# Altium schematic sheet 16_HDMI接口.schdoc.schdoc
size 309 x 223 mm; Symbol: Sheet-Symbol_A4; Device: Sheet-Symbol_A4; Company: 嘉立创EDA; Version: V1.0; Page Size: A4; @Project Name: RK3568底板_V1.2; @Page Count: 6; @Update Date: 2024-04-26; @Create Date: 2024-04-18; @Schematic Name: 原理图; @Page No: 4; @Page Name: HDMI接口
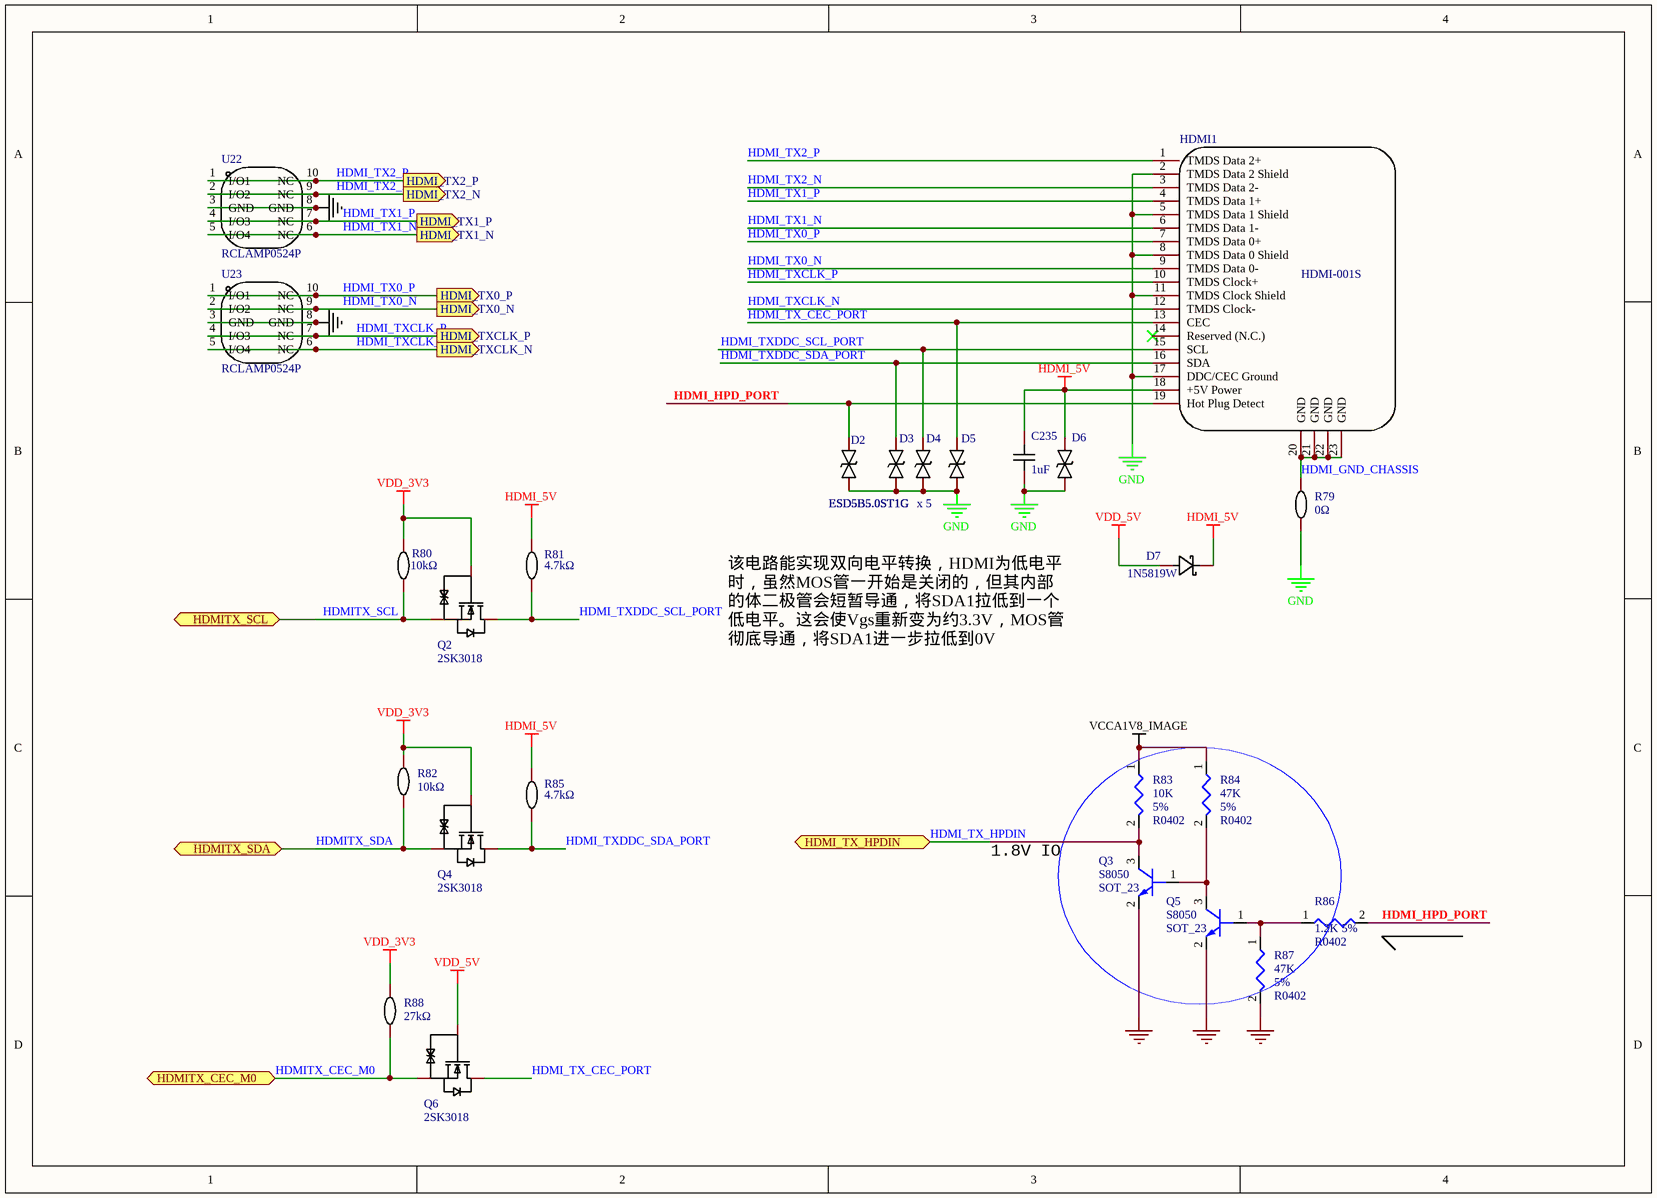
[diagram p0: 16_HDMI接口.schdoc.schdoc]

## Parts
C235  1uF  [C0603]
D2  ESD5B5.0ST1G  [SOD-523_L1.2-W0.8-LS1.6-BI]
D3  ESD5B5.0ST1G  [SOD-523_L1.2-W0.8-LS1.6-BI]
D4  ESD5B5.0ST1G  [SOD-523_L1.2-W0.8-LS1.6-BI]
D5  ESD5B5.0ST1G  [SOD-523_L1.2-W0.8-LS1.6-BI]
D6  ESD5B5.0ST1G  [SOD-523_L1.2-W0.8-LS1.6-BI]
D7  1N5819W  [SOD-123_L2.7-W1.6-LS3.7-R-RD]
HDMI1  HDMI-001S  [HDMI-SMD_HDMI-001S]
Q2  2SK3018  [SOT-23-3_L2.9-W1.4-P1.90-LS2.6-BR]
Q3  S8050  [SOT_23]
Q4  2SK3018  [SOT-23-3_L2.9-W1.4-P1.90-LS2.6-BR]
Q5  S8050  [SOT_23]
Q6  2SK3018  [SOT-23-3_L2.9-W1.4-P1.90-LS2.6-BR]
R79  0Ω  [R0603]
R80  10kΩ  [R0603]
R81  4.7kΩ  [R0603]
R82  10kΩ  [R0603]
R83  10K  Tolerance: 5%  [R0402]
R84  47K  Tolerance: 5%  [R0402]
R85  4.7kΩ  [R0603]
R86  1.2K  Tolerance: 5%  [R0402]
R87  47K  Tolerance: 5%  [R0402]
R88  27kΩ  [R0603]
U22  RCLAMP0524P  [DFN2510-10_L2.5-W1.0-P0.50-BL]
U23  RCLAMP0524P  [DFN2510-10_L2.5-W1.0-P0.50-BL]

## Ports
HDMI_TX0_N (out), HDMI_TX0_P (out), HDMI_TX1_N (out), HDMI_TX1_P (out), HDMI_TX2_N (out), HDMI_TX2_P (out), HDMI_TX_HPDIN (bidir), HDMI_TXCLK_N (out), HDMI_TXCLK_P (out), HDMITX_CEC_M0 (bidir), HDMITX_SCL (bidir), HDMITX_SDA (bidir)

## Nets
GND: C235.1 D2.1 D3.1 D4.1 D5.1 D6.1 HDMI1.2(TMDS_Data_2_Shield) HDMI1.5(TMDS_Data_1_Shield) HDMI1.8(TMDS_Data_0_Shield) HDMI1.11(TMDS_Clock_Shield) HDMI1.17(DDC/CEC_Ground) Q3.2(EMITTER) Q5.2(EMITTER) R79.1 R87.2 U22.3(GND) U22.8(GND) U23.3(GND) U23.8(GND)
HDMI_5V: C235.2 D6.2 D7.2(C) HDMI1.18(+5V_Power) R81.2 R85.2
VCCA1V8_IMAGE: R83.1 R84.1
VDD_3V3: Q2.1(G) Q4.1(G) R80.2 R82.2 R88.2
VDD_5V: D7.1(A) Q6.1(G)
HDMI_GND_CHASSIS: HDMI1.20(GND) HDMI1.21(GND) HDMI1.22(GND) HDMI1.23(GND) R79.2
HDMI_HPD_PORT: D2.2 HDMI1.19(Hot_Plug_Detect) R86.2
HDMI_TX0_N: HDMI1.9(TMDS_Data_0-) U23.2(I/O2) U23.9(NC) ; port HDMI_TX0_N
HDMI_TX0_P: HDMI1.7(TMDS_Data_0+) U23.1(I/O1) U23.10(NC) ; port HDMI_TX0_P
HDMI_TX1_N: HDMI1.6(TMDS_Data_1-) U22.5(I/O4) U22.6(NC) ; port HDMI_TX1_N
HDMI_TX1_P: HDMI1.4(TMDS_Data_1+) U22.4(I/O3) U22.7(NC) ; port HDMI_TX1_P
HDMI_TX2_N: HDMI1.3(TMDS_Data_2-) U22.2(I/O2) U22.9(NC) ; port HDMI_TX2_N
HDMI_TX2_P: HDMI1.1(TMDS_Data_2+) U22.1(I/O1) U22.10(NC) ; port HDMI_TX2_P
HDMI_TX_CEC_PORT: D5.2 HDMI1.13(CEC) Q6.3(D)
HDMI_TX_HPDIN: Q3.3(COLLECTOR) R83.2 ; port HDMI_TX_HPDIN
HDMI_TXCLK_N: HDMI1.12(TMDS_Clock-) U23.5(I/O4) U23.6(NC) ; port HDMI_TXCLK_N
HDMI_TXCLK_P: HDMI1.10(TMDS_Clock+) U23.4(I/O3) U23.7(NC) ; port HDMI_TXCLK_P
HDMI_TXDDC_SCL_PORT: D4.2 HDMI1.15(SCL) Q2.3(D) R81.1
HDMI_TXDDC_SDA_PORT: D3.2 HDMI1.16(SDA) Q4.3(D) R85.1
HDMITX_CEC_M0: Q6.2(S) R88.1 ; port HDMITX_CEC_M0
HDMITX_SCL: Q2.2(S) R80.1 ; port HDMITX_SCL
HDMITX_SDA: Q4.2(S) R82.1 ; port HDMITX_SDA
NetQ3_1: Q3.1(BASE) Q5.3(COLLECTOR) R84.2
NetQ5_1: Q5.1(BASE) R86.1 R87.1

Not connected (* = marked no-connect by the designer): HDMI1 14(Reserved_(N.C.))*

## Notes on the sheet
- x 5
- 该电路能实现双向电平转换，HDMI为低电平时，虽然MOS管一开始是关闭的，但其内部的体二极管会短暂导通，将SDA1拉低到一个低电平。这会使Vgs重新变为约3.3V，MOS管彻底导通，将SDA1进一步拉低到0V
- 1.8V IO
- 1
- 2
- 3
- 4
- 5
- 6
- A
- B
- C
- 原理图
- 创建日期
- 更新日期
- 2024-04-26
- 2024-04-18
- 审阅
- 绘制
- 图页
- HDMI接口
- 物料编码
- RK3568底板_V1.2
- D
- 版本
- 尺寸
- 页
- 共
- V1.0
- A4
- 嘉立创EDA

## Library data of the parts
C235 = CL10A105KB8NNNC: Manufacturer: SAMSUNG(三星); Add into BOM: yes; Tolerance: ±10%; Voltage Rated: 50V; Temperature Coefficient: X5R; Name: 1uF; Symbol: CL10A105KB8NNNC; Device: CL10A105KB8NNNC; LCSC Part Name: 1uF ±10% 50V; Supplier Part: C15849; Manufacturer Part: CL10A105KB8NNNC; Supplier Footprint: 0603; JLCPCB Part Class: 基础库; Datasheet: https://atta.szlcsc.com/upload/public/pdf/source/20160218/1457707763339.pdf; Supplier: LCSC; Convert to PCB: yes; Value: 1uF
D2-D6 = ESD5B5.0ST1G: Manufacturer: onsemi(安森美); Add into BOM: yes; polarity: 双向; Reverse Stand-Off Voltage (Vrwm): 5V; Peak Pulse Power Dissipation (Ppp)@10/1000us: 50W; Breakdown Voltage: 5.8V; Type: ESD; Name: ESD5B5.0ST1G; Symbol: ESD5B5.0ST1G; Device: ESD5B5.0ST1G; Supplier: LCSC; Manufacturer Part: ESD5B5.0ST1G; Supplier Part: C93623; JLCPCB Part Class: 扩展库; LCSC Part Name: 双向ESD; Supplier Footprint: SOD-523; Datasheet: https://atta.szlcsc.com/upload/public/pdf/source/20170728/C93623_1501225905857849086.PDF; Convert to PCB: yes; Operating Temperature: -55℃~+150℃@(Tj)
D7 = 1N5819W_C963381: Manufacturer: JSMSEMI(杰盛微); Add into BOM: yes; Diode Configuration: 独立式; Forward Voltage (Vf@If): 600mV@200mA; Reverse Voltage (Vr): 40V; Average Rectified Current (Io): 350mA; Reverse Leakage Current (Ir): 5uA@30V; Name: 1N5819W; Symbol: 1N5819W_C963381; Device: 1N5819W_C963381; LCSC Part Name: 电压:40V 电流:350mA; Supplier Part: C963381; Manufacturer Part: 1N5819W; Supplier Footprint: SOD-123; JLCPCB Part Class: 扩展库; Datasheet: https://atta.szlcsc.com/upload/public/pdf/source/20230807/ADD53622154D5B572F84A7B877E922CE.pdf; Supplier: LCSC; Convert to PCB: yes
HDMI1 = HDMI-001S: Manufacturer: XUNPU(讯普); Add into BOM: yes; Connector Type: HDMI; Gender: 母; Current Rating (Max): 500mA; Name: HDMI-001S; Symbol: HDMI-001S; Device: HDMI-001S; LCSC Part Name: HDMI 母 P数:19P; Supplier Part: C720616; Manufacturer Part: HDMI-001S; Supplier Footprint: SMD; JLCPCB Part Class: 扩展库; Datasheet: https://atta.szlcsc.com/upload/public/pdf/source/20230810/ECFF1CC9EF38DC7E290ED6B9AC4EFC06.pdf; Supplier: LCSC; Convert to PCB: yes; Number of Pins: 19P; Mounting Style: 卧贴; Number of Rows: 1; Contact Material: -; Contact Plating: -; Operating Temperature Range: -45℃~+85℃
Q2 Q4 Q6 = 2SK3018: Manufacturer: TWGMC(台湾迪嘉); Symbol: 2SK3018_C727148; Add into BOM: yes; Name: 2SK3018; Device: 2SK3018; Supplier: LCSC; Supplier Part: C727148; Manufacturer Part: 2SK3018; JLCPCB Part Class: 扩展库; LCSC Part Name: 2SK3018; Supplier Footprint: SOT-23; Datasheet: https://atta.szlcsc.com/upload/public/pdf/source/20200827/C727148_2301BBDB89FCE642A4A39ABEF7075607.pdf; Convert to PCB: yes; Type: -; Drain Source Voltage (Vdss): -; Continuous Drain Current (Id): -; Power Dissipation (Pd): -; Drain Source On Resistance (RDS(on)@Vgs,Id): -; Gate Threshold Voltage (Vgs(th)@Id): -; Total Gate Charge (Qg@Vgs): -; Input Capacitance (Ciss@Vds): -; Reverse Transfer Capacitance (Crss@Vds): -
Q3 Q5 = NPN: S8050,SOT23; Manufacturer PN: S8050_SOT23; Manufacturer: 长电; Pc: 0.3W; Vceo: 25V; Ic: 0.5A; Priority: A; PCB Footprint: SOT_23; Created by: JJJ; Part Type: NPN; RK PN: S8050
R79 = 0603WAF0000T5E: Manufacturer: UNI-ROYAL(厚声); Add into BOM: yes; Tolerance: ±1%; Power(Watts): 100mW; Overload Voltage (Max): 75V; Name: 0Ω; Symbol: 0603WAF0000T5E; Device: 0603WAF0000T5E; Supplier: LCSC; Manufacturer Part: 0603WAF0000T5E; Supplier Part: C21189; Value: 0Ω; JLCPCB Part Class: 基础库; LCSC Part Name: 0Ω ±1% 100mW 厚膜电阻; Supplier Footprint: 0603; Datasheet: https://atta.szlcsc.com/upload/public/pdf/source/20200306/C422600_1E6D84923E4A46A82E41ADD87F860B5C.pdf; Convert to PCB: yes; Type: 厚膜电阻; Operating Temperature Range: -55℃~+155℃
R80 R82 = 0603WAF1002T5E: Manufacturer: UNI-ROYAL(厚声); Add into BOM: yes; Tolerance: ±1%; Power(Watts): 100mW; Overload Voltage (Max): 75V; Temperature Coefficient: ±100ppm/℃; Name: 10kΩ; Symbol: 0603WAF1002T5E; Device: 0603WAF1002T5E; Supplier: LCSC; Manufacturer Part: 0603WAF1002T5E; Supplier Part: C25804; Value: 10kΩ; JLCPCB Part Class: 基础库; LCSC Part Name: 厚膜电阻 10kΩ ±1% 100mW; Supplier Footprint: 0603; Datasheet: https://atta.szlcsc.com/upload/public/pdf/source/20200306/C422600_1E6D84923E4A46A82E41ADD87F860B5C.pdf; Convert to PCB: yes; Type: 厚膜电阻; Operating Temperature Range: -55℃~+155℃
R81 R85 = 0603WAF4701T5E: Manufacturer: UNI-ROYAL(厚声); Add into BOM: yes; Tolerance: ±1%; Power(Watts): 100mW; Overload Voltage (Max): 75V; Temperature Coefficient: ±100ppm/℃; Name: 4.7kΩ; Symbol: 0603WAF4701T5E; Device: 0603WAF4701T5E; Supplier: LCSC; Manufacturer Part: 0603WAF4701T5E; Supplier Part: C23162; Value: 4.7kΩ; JLCPCB Part Class: 基础库; LCSC Part Name: 4.7kΩ ±1% 100mW 厚膜电阻; Supplier Footprint: 0603; Datasheet: https://atta.szlcsc.com/upload/public/pdf/source/20200306/C422600_1E6D84923E4A46A82E41ADD87F860B5C.pdf; Convert to PCB: yes; Type: 厚膜电阻; Operating Temperature Range: -55℃~+155℃
R83 = RESISTOR_Dup1: 通用厚膜电阻,10K,+/-5%,R0402,1/16W.; Manufacturer: YAGEO; RK PN: RC0402JR-0710KL; Priority: A; Wattage: 1/16W; PCB Footprint: R0402; Part Type: 通用厚膜电阻; Manufacturer PN: RC0402JR-0710KL; Created by: YTL
R84 R87 = RESISTOR_Dup1: 通用厚膜电阻,47K,+/-5%,R0402,1/16W.; Manufacturer PN: RC0402JR-0747KL; Manufacturer: YAGEO; Wattage: 1/16W; Priority: A; PCB Footprint: R0402; Created by: YTL; Part Type: 通用厚膜电阻; RK PN: RC0402JR-0747KL
R86 = RESISTOR_Dup1: 通用厚膜电阻,1K2,+/-5%,R0402,1/16W.; Manufacturer: YAGEO; RK PN: RC0402JR-071K2L; Priority: A; Wattage: 1/16W; PCB Footprint: R0402; Part Type: 通用厚膜电阻; Manufacturer PN: RC0402JR-071K2L; Created by: YTL
R88 = 0603WAF2702T5E: Manufacturer: UNI-ROYAL(厚声); Add into BOM: yes; Tolerance: ±1%; Power(Watts): 100mW; Overload Voltage (Max): 75V; Temperature Coefficient: ±100ppm/℃; Name: 27kΩ; Symbol: 0603WAF2702T5E; Device: 0603WAF2702T5E; Supplier: LCSC; Manufacturer Part: 0603WAF2702T5E; Supplier Part: C22967; Value: 27kΩ; JLCPCB Part Class: 基础库; LCSC Part Name: 27kΩ ±1% 100mW 厚膜电阻; Supplier Footprint: 0603; Datasheet: https://atta.szlcsc.com/upload/public/pdf/source/20200306/C422600_1E6D84923E4A46A82E41ADD87F860B5C.pdf; Convert to PCB: yes; Type: 厚膜电阻; Operating Temperature Range: -55℃~+155℃
U22 U23 = RCLAMP0524P_C907837: Manufacturer: TECH PUBLIC(台舟); Add into BOM: yes; Name: RCLAMP0524P; Symbol: RCLAMP0524P_C907837; Device: RCLAMP0524P_C907837; LCSC Part Name: RCLAMP0524P; Supplier Part: C907837; Manufacturer Part: RCLAMP0524P; Supplier Footprint: DFN2510-10; JLCPCB Part Class: 扩展库; Datasheet: https://atta.szlcsc.com/upload/public/pdf/source/20210810/AE3DE9AC94AD2A317FD9BEA10653400F.pdf; Supplier: LCSC; Convert to PCB: yes; Type: ESD